# Altium project oysm_Keyboard.PrjPCB
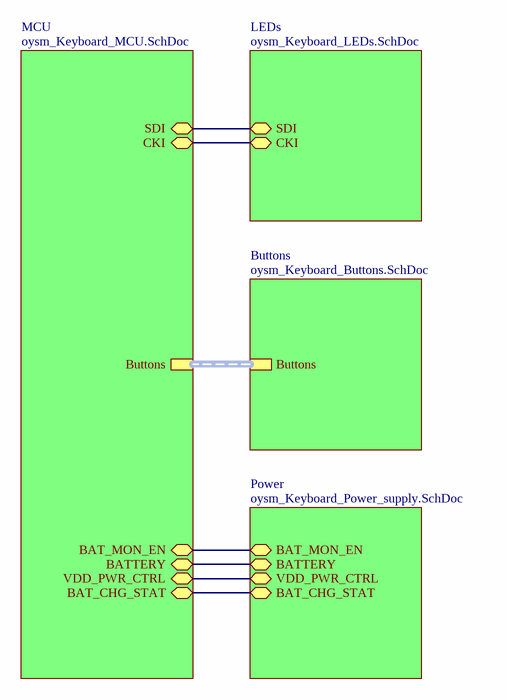
[diagram p0: oysm_Keyboard_Top.SchDoc]
5 sheets, 115 parts. Net scope: hierarchical (ports join the sheet entries above them; power ports are global).
Board file: oysm_Keyboard.PcbDoc
Sheets:
  oysm_Keyboard_Top.SchDoc
    MCU = oysm_Keyboard_MCU.SchDoc
    Power = oysm_Keyboard_Power_supply.SchDoc
    Buttons = oysm_Keyboard_Buttons.SchDoc
    LEDs = oysm_Keyboard_LEDs.SchDoc

## Sheet oysm_Keyboard_Top.SchDoc: PCA70107 Top
size A4; DocumentNumber: 1; Revision: 0; SheetNumber: 1; SheetTotal: 4; ProjectNumber: <Project number>; DocumentSize: A4; PCBRevision: <PCB designer code>

### Sub-sheets
Buttons = oysm_Keyboard_Buttons.SchDoc: Buttons (harness Harness)
LEDs = oysm_Keyboard_LEDs.SchDoc: SDI (bidir), CKI (bidir)
MCU = oysm_Keyboard_MCU.SchDoc: Buttons (harness Harness), BATTERY (bidir), BAT_MON_EN (bidir), BAT_CHG_STAT (bidir), VDD_PWR_CTRL (bidir), SDI (bidir), CKI (bidir)
Power = oysm_Keyboard_Power_supply.SchDoc: BAT_MON_EN (bidir), BATTERY (bidir), VDD_PWR_CTRL (bidir), BAT_CHG_STAT (bidir)

### Nets
P0.04/AIN2: sheet MCU/BATTERY, sheet Power/BATTERY
P0.06: sheet MCU/SDI, sheet LEDs/SDI
P0.13: sheet MCU/VDD_PWR_CTRL, sheet Power/VDD_PWR_CTRL
P0.15: sheet MCU/BAT_MON_EN, sheet Power/BAT_MON_EN
P0.26: sheet MCU/CKI, sheet LEDs/CKI
P1.00/TRC0: sheet MCU/BAT_CHG_STAT, sheet Power/BAT_CHG_STAT

### Buses and harness runs
harness sheet Buttons/Buttons = sheet MCU/Buttons

### Notes on the sheet
- Title
- Size
- Date:
- Project Number
- Sheet         of
- Revision
- File:
- Drawn By:

## Sheet oysm_Keyboard_MCU.SchDoc: PCA70141 MCU
size A3; DocumentNumber: 2; Revision: 0; SheetNumber: 2; SheetTotal: 4; ProjectNumber: <Project number>; DocumentSize: A4; PCBRevision: <PCB designer code>
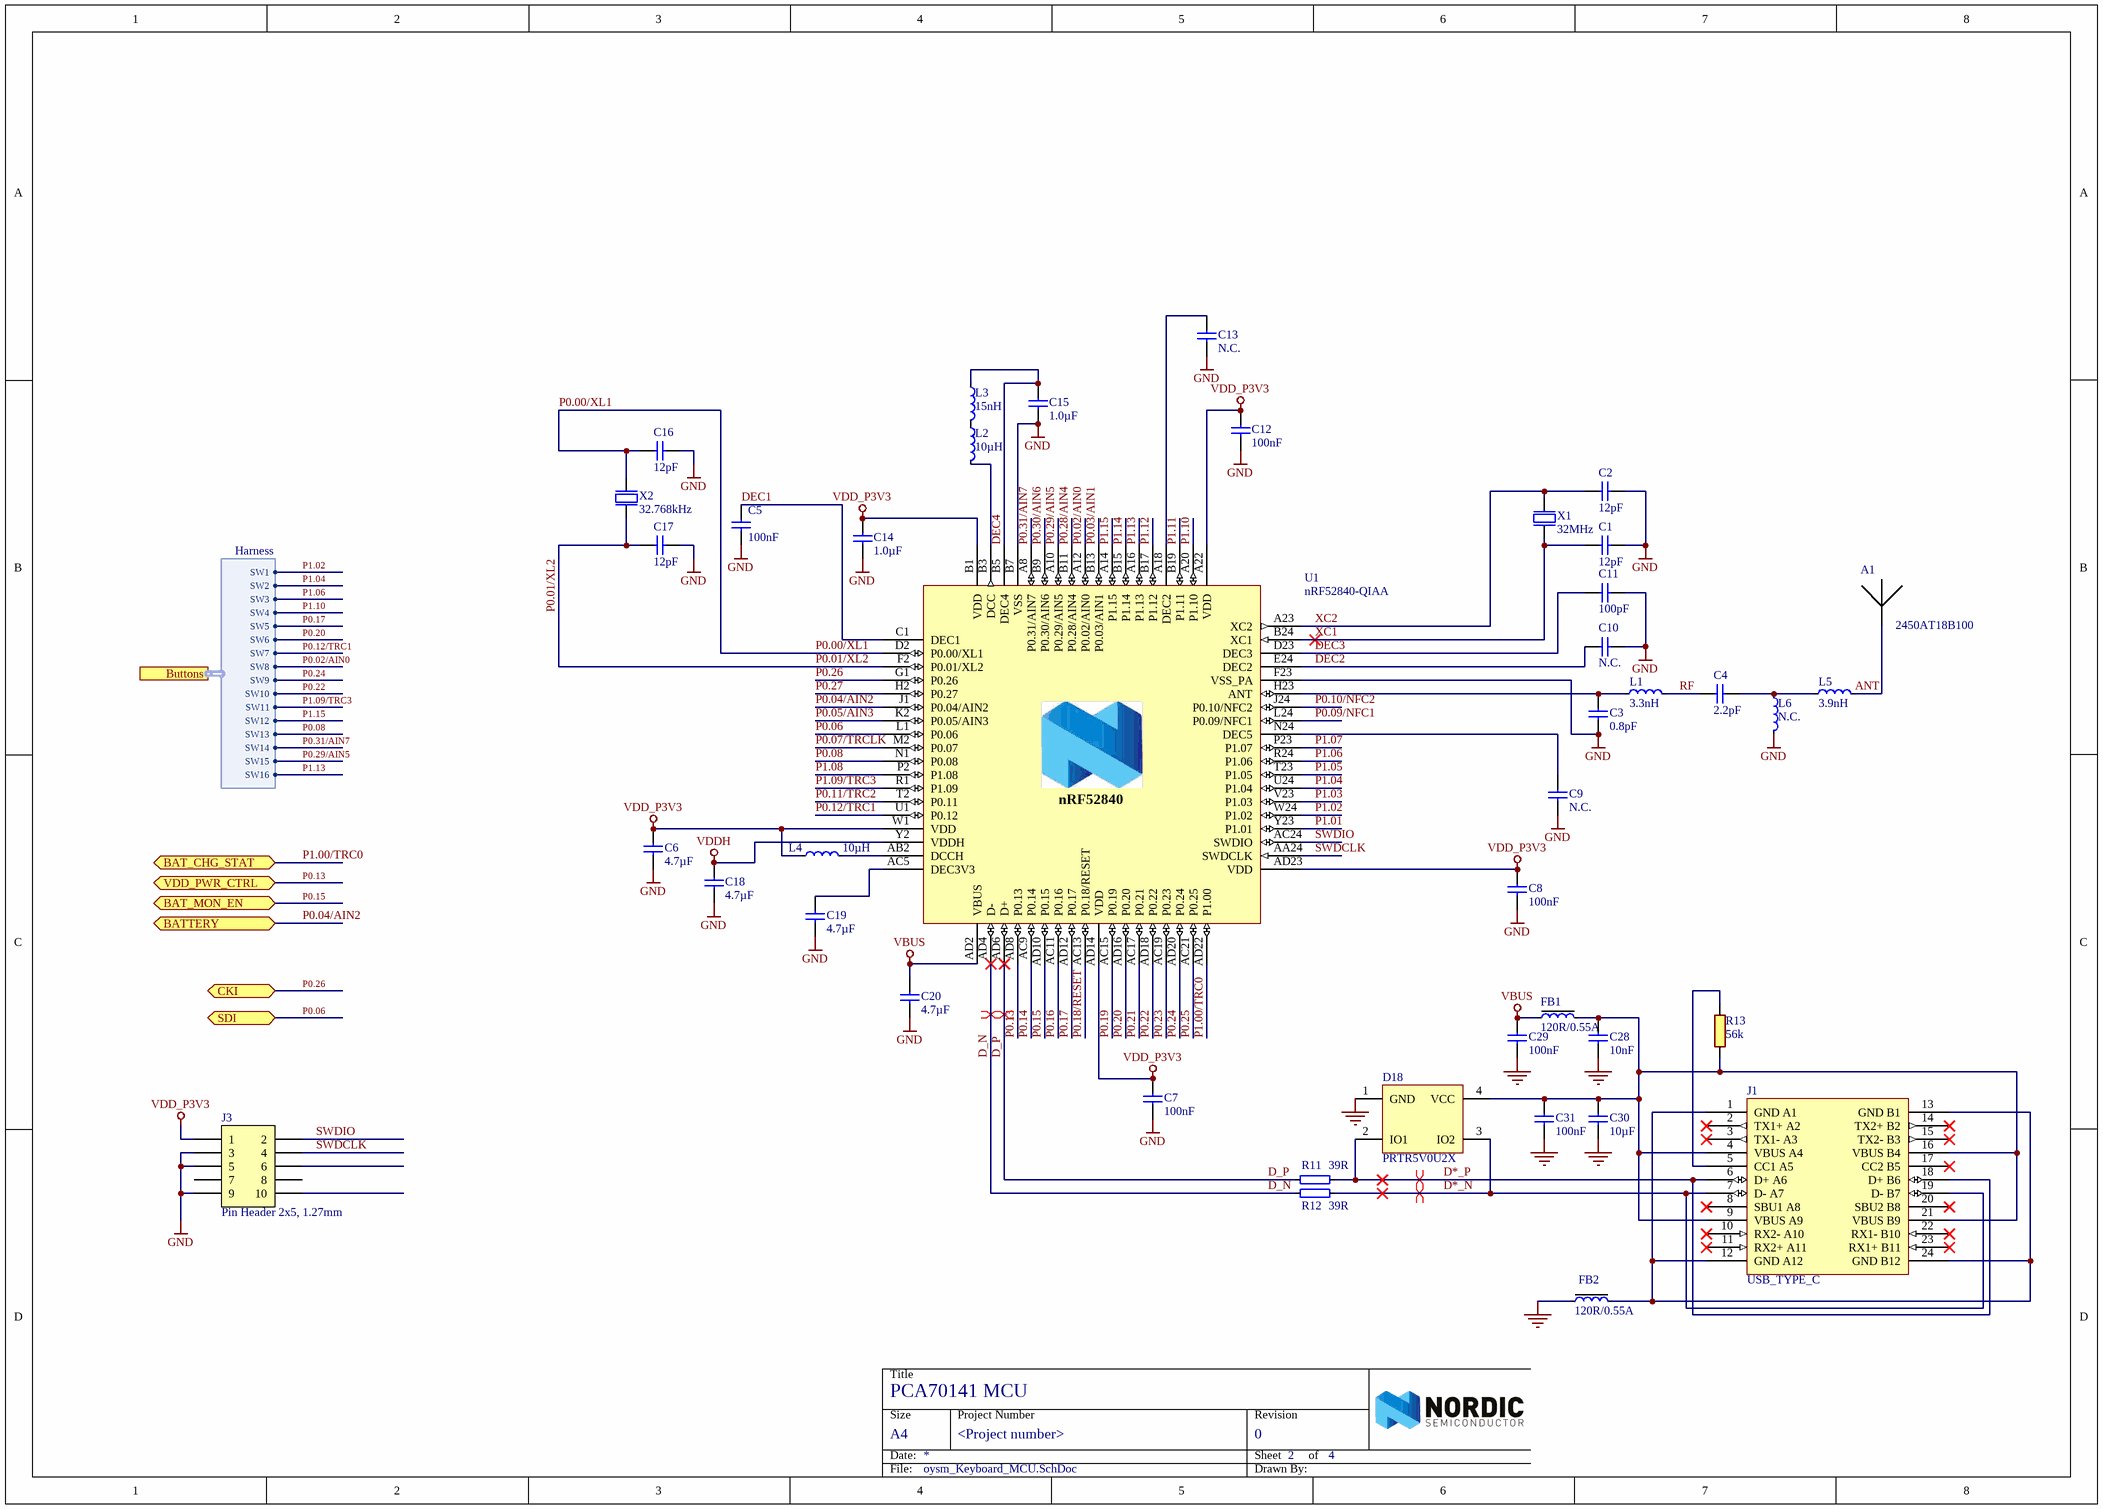
[diagram p1: oysm_Keyboard_MCU.SchDoc]

### Parts
A1  2450AT18B100  [2450AT18B100]
C1  12pF  [CAPC1005X04L]
C2  12pF  [CAPC1005X04L]
C3  0.8pF  [CAPC1005X04L]
C4  2.2pF  [CAPC1005X04L]
C5  100nF  [CAPC1005X04L]
C6  4.7µF  [CAPC1608X06L]
C7  100nF  [CAPC1005X04L]
C8  100nF  [CAPC1005X04L]
C9  N.C.  [CAPC1005X04L]
C10  N.C.  [CAPC1005X04L]
C11  100pF  [CAPC1005X04L]
C12  100nF  [CAPC1005X04L]
C13  N.C.  [CAPC1005X04L]
C14  1.0µF  [CAPC1608X06L]
C15  1.0µF  [CAPC1608X06L]
C16  12pF  [CAPC1005X04L]
C17  12pF  [CAPC1005X04L]
C18  4.7µF  [CAPC1608X06L]
C19  4.7µF  [CAPC1608X06L]
C20  4.7µF  [CAPC1608X06L]
C28  10nF  [CAPC1005X04L]
C29  100nF  [CAPC1005X04L]
C30  10µF  [CAPC1608X06L]
C31  100nF  [CAPC1005X04L]
D18  PRTR5V0U2X  [SOT190P230X110-4L]
FB1  120R/0.55A  [INDC1005X04L]
FB2  120R/0.55A  [INDC1005X04L]
J1  USB_TYPE_C  [USB_TYPE_C_JST]
J3  Pin Header 2x5, 1.27mm  [HDR_2x5-SMD-1.27mm-K]
L1  3.3nH  [INDC1005X04L]
L2  10µH  [INDC1608X06L]
L3  15nH  [INDC1005X04L]
L4  10µH  [INDC1608X06L]
L5  3.9nH  [INDC1005X04L]
L6  N.C.  [INDC1005X04L]
R11  39R  [RESC1005X04L]
R12  39R  [RESC1005X04L]
R13  56k  [RESC0402(1005)_L]
U1  nRF52840-QIAA  [AQFN50P700X700X85_HS-74N]
X1  32MHz  [BT-XTAL_2016]
X2  32.768kHz  [XTAL_3215]

### Ports
BAT_CHG_STAT (bidir), BAT_MON_EN (bidir), BATTERY (bidir), Buttons (harness Harness), CKI (bidir), SDI (bidir), VDD_PWR_CTRL (bidir)

### Harnesses
Harness: SW1, SW2, SW3, SW4, SW5, SW6, SW7, SW8, SW9, SW10, SW11, SW12, SW13, SW14, SW15, SW16

### Nets
GND: C1.2 C2.2 C3.1 C5.2 C6.2 C7.2 C8.2 C9.2 C10.1 C11.2 C12.2 C13.2 C14.2 C15.1 C16.1 C17.1 C18.2 C19.2 C20.2 C28.1 C29.1 C30.1 C31.1 D18.1(GND) FB2.2 J3.3 J3.5 J3.9 L6.2 U1.74(GND) U1.B7(VSS) U1.F23(VSS_PA) X1.2(GND) X1.4(GND)
VBUS: C20.1 C29.2 FB1.2 U1.AD2(VBUS)
VDD_P3V3: C6.1 C7.1 C8.1 C12.1 C14.1 J3.1 L4.1 U1.A22(VDD) U1.AD14(VDD) U1.AD23(VDD) U1.B1(VDD) U1.W1(VDD)
VDDH: C18.1 U1.Y2(VDDH)
ANT: A1.1 L5.2
D*_N: D18.3(IO2) J1.7(D-_A7) J1.19(D-_B7) R11.2
D*_P: D18.2(IO1) J1.6(D+_A6) J1.18(D+_B6) R12.2
D_N: R11.1 U1.AD4(D-)
D_P: R12.1 U1.AD6(D+)
DEC1: C5.1 U1.C1(DEC1)
DEC2: C10.2 U1.E24(DEC2)
DEC3: C11.1 U1.D23(DEC3)
DEC4: C15.2 L3.1 U1.B5(DEC4)
P0.00/XL1: C16.2 U1.D2(P0.00/XL1) X2.1(inp)
P0.01/XL2: C17.2 U1.F2(P0.01/XL2) X2.2(out)
P0.02/AIN0: U1.A12(P0.02/AIN0) ; port Buttons.SW8
P0.03/AIN1: U1.B13(P0.03/AIN1)
P0.04/AIN2: U1.J1(P0.04/AIN2) ; port BATTERY
P0.05/AIN3: U1.K2(P0.05/AIN3)
P0.06: U1.L1(P0.06) ; port SDI
P0.07/TRCLK: U1.M2(P0.07)
P0.08: U1.N1(P0.08) ; port Buttons.SW13
P0.09/NFC1: U1.L24(P0.09/NFC1)
P0.10/NFC2: U1.J24(P0.10/NFC2)
P0.11/TRC2: U1.T2(P0.11)
P0.12/TRC1: U1.U1(P0.12) ; port Buttons.SW7
P0.13: U1.AD8(P0.13) ; port VDD_PWR_CTRL
P0.14: U1.AC9(P0.14)
P0.15: U1.AD10(P0.15) ; port BAT_MON_EN
P0.16: U1.AC11(P0.16)
P0.17: U1.AD12(P0.17) ; port Buttons.SW5
P0.18/RESET: U1.AC13(P0.18/RESET)
P0.19: U1.AC15(P0.19)
P0.20: U1.AD16(P0.20) ; port Buttons.SW6
P0.21: U1.AC17(P0.21)
P0.22: U1.AD18(P0.22) ; port Buttons.SW10
P0.23: U1.AC19(P0.23)
P0.24: U1.AD20(P0.24) ; port Buttons.SW9
P0.25: U1.AC21(P0.25)
P0.26: U1.G1(P0.26) ; port CKI
P0.27: U1.H2(P0.27)
P0.28/AIN4: U1.B11(P0.28/AIN4)
P0.29/AIN5: U1.A10(P0.29/AIN5) ; port Buttons.SW15
P0.30/AIN6: U1.B9(P0.30/AIN6)
P0.31/AIN7: U1.A8(P0.31/AIN7) ; port Buttons.SW14
P1.00/TRC0: U1.AD22(P1.00) ; port BAT_CHG_STAT
P1.01: U1.Y23(P1.01)
P1.02: U1.W24(P1.02) ; port Buttons.SW1
P1.03: U1.V23(P1.03)
P1.04: U1.U24(P1.04) ; port Buttons.SW2
P1.05: U1.T23(P1.05)
P1.06: U1.R24(P1.06) ; port Buttons.SW3
P1.07: U1.P23(P1.07)
P1.08: U1.P2(P1.08)
P1.09/TRC3: U1.R1(P1.09) ; port Buttons.SW11
P1.10: U1.A20(P1.10) ; port Buttons.SW4
P1.11: U1.B19(P1.11)
P1.12: U1.B17(P1.12)
P1.13: U1.A16(P1.13) ; port Buttons.SW16
P1.14: U1.B15(P1.14)
P1.15: U1.A14(P1.15) ; port Buttons.SW12
RF: C4.2 L1.2
SWDCLK: J3.4 U1.AA24(SWDCLK)
SWDIO: J3.2 U1.AC24(SWDIO)
XC1: C1.1 U1.B24(XC1) X1.1(inp)
XC2: C2.1 U1.A23(XC2) X1.3(out)
NetC3_2: C3.2 L1.1 U1.H23(ANT)
NetC4_1: C4.1 L5.1 L6.1
NetC9_1: C9.1 U1.N24(DEC5)
NetC13_1: C13.1 U1.A18(DEC2)
NetC19_1: C19.1 U1.AC5(DEC3V3)
NetC28_2: C28.2 C30.2 C31.2 D18.4(VCC) FB1.1 J1.4(VBUS_A4) J1.9(VBUS_A9) J1.16(VBUS_B4) J1.21(VBUS_B9) R13.1
NetFB2_1: FB2.1 J1.1(GND_A1) J1.12(GND_A12) J1.13(GND_B1) J1.24(GND_B12)
NetJ1_5: J1.5(CC1_A5) R13.2
NetL2_1: L2.1 L3.2
NetL2_2: L2.2 U1.B3(DCC)
NetL4_2: L4.2 U1.AB2(DCCH)

Not connected (* = marked no-connect by the designer): J1 2(TX1+_A2)* 3(TX1-_A3)* 8(SBU1_A8)* 10(RX2-_A10)* 11(RX2+_A11)* 14(TX2+_B2)* 15(TX2-_B3)* 17(CC2_B5)* 20(SBU2_B8)* 22(RX1-_B10)* 23(RX1+_B11)*; J3 6 7 8 10

### Layout directives
differential pair: D*_N, D*_P, D_N, D_P

### Notes on the sheet
- Title
- Size
- Date:
- Project Number
- Sheet         of
- Revision
- File:
- Drawn By:
- (in symbol nRF52840-QIAAAA) nRF52840

### Library data of the parts
A1 = Johanson 2450AT18B100: 2.45 GHz chip antenna; Manufacturer: Johanson Technology; Part number IPS: 00000007781; Artikkelnr Noca: N.A.; Part Number: Johanson 2450AT18B100; Manufacturer Part Number: 2450AT18B100; ComponentLink1URL: *; ComponentLink1Description: Datasheet; ComponentLink2URL: *; ComponentLink2Description: Supplier link; HelpURL: http://www.johansontechnology.com/datasheets/antennas/2450AT18B100.pdf; Footprint Doc: 2450AT18B100; LatestRevisionDate: 2013-09-13; Pin Count: 2; Publisher: Nordic Semiconductor; Published: 2013-09-13; Value: 2450AT18B100; Note: *; Supplier 1: Digi-Key; Supplier Part Number 1: 712-1006-1-ND; Supplier 2: *; Supplier Part Number 2: *
C1 C2 C16 C17 = C0402-12p: Capacitor, NP0, ±2%; Part number IPS: 00000002398; Note: 50V; Artikkelnr Noca: 20029159; Artikkelnr Simpro: N.A.; Part Number: C0402-12p; Manufacturer: *; Manufacturer Part Number: *; Datasheet: *; LatestRevisionDate: 2011-05-11; Pin Count: 2; Publisher: Nordic Semiconductor; Published: 2009-05-08; Value: 12pF; Supplier: *; Supplier part number: *; 2nd source Supplier: *; 2nd source part number: *; Footprint Doc: 0402
C3 = C0402-0.8p: Capacitor, NP0, ±5%; Note: 50V; Artikkelnr Noca: 20029147; Artikkelnr Simpro: N.A.; Part Number: C0402-0.8p; Manufacturer: *; Manufacturer Part Number: *; Datasheet: *; LatestRevisionDate: 2012-11-21; Pin Count: 2; Publisher: Nordic Semiconductor; Published: 2009-05-08; Value: 0.8pF; Supplier: *; Supplier part number: *; 2nd source Supplier: *; 2nd source part number: *; Footprint Doc: 0402
C4 = C0402-2.2p: Capacitor, NP0, ±0.1pF; Part number IPS: 00000003105; Note: 50V; Artikkelnr Noca: 20029145; Part Number: C0402-2.2p; Manufacturer: *; Manufacturer Part Number: *; LatestRevisionDate: 2017-02-23; Pin Count: 2; Publisher: Nordic Semiconductor; Published: 2009-05-08; Value: 2.2pF; Footprint Doc: 0402; ComponentLink1URL: *; ComponentLink1Description: Datasheet; ComponentLink2URL: *; ComponentLink2Description: Supplier link; HelpURL: *; Supplier 1: Digi-Key; Supplier Part Number 1: 490-8092-1-ND; Supplier 2: *; Supplier Part Number 2: *
C5 C7 C8 C12 C29 C31 = C0402-100n: Capacitor, X7R, ±10%; Part number IPS: 00000005296; Note: 16V; Artikkelnr Noca: 20039200; Artikkelnr Simpro: N.A.; Part Number: C0402-100n; Manufacturer: *; Manufacturer Part Number: *; Datasheet: *; LatestRevisionDate: 2009-11-23; Pin Count: 2; Publisher: Nordic Semiconductor; Published: 2009-05-08; Value: 100nF; Supplier: *; Supplier part number: *; 2nd source Supplier: *; 2nd source part number: *; Footprint Doc: 0402
C6 = C0603-4µ7-6.3V-X7R: Capacitor, X7R, ±10%, 6.3V; Manufacturer: Samsung; Manufacturer Part Number: CL10B475KQ8NQNC; Artikkelnr Noca: 20039473; Artikkelnr Simpro: N.A.; Part Number: C0603-4µ7-6.3V-X7R; Datasheet: http://media.digikey.com/pdf/Data%20Sheets/Samsung%20PDFs/CL10B475KQ8NQNC_Spec.pdf; LatestRevisionDate: 2015-06-10; Pin Count: 2; Publisher: Nordic Semiconductor; Published: 2015-06-10; Value: 4.7µF; Note: 6.3V; Supplier: Digi-Key; Supplier part number: 1276-2087-1-ND; 2nd source Supplier: *; 2nd source part number: *; Footprint Doc: 0603
C9 C10 C13 = C0402-N.C.: Not mounted; Note: Chip Cap; Artikkelnr Noca: N.A.; Assembly: Not mounted; Part Number: C0402-N.C.; Manufacturer: *; Manufacturer Part Number: *; Datasheet: *; LatestRevisionDate: 2009-05-08; Pin Count: 2; Publisher: Nordic Semiconductor; Published: 2009-05-08; Value: N.C.; Supplier: *; Supplier part number: *; 2nd source Supplier: *; 2nd source part number: *; Footprint Doc: 0402; Artikkelnr Simpro: N.A.
C11 = C0402-100p: Capacitor, NP0, ±5%; Part number IPS: 00000002361; Note: 50V; Artikkelnr Noca: 20029135; Artikkelnr Simpro: N.A.; Part Number: C0402-100p; Manufacturer: *; Manufacturer Part Number: *; Datasheet: *; LatestRevisionDate: 2009-05-08; Pin Count: 2; Publisher: Nordic Semiconductor; Published: 2009-05-08; Value: 100pF; Supplier: *; Supplier part number: *; 2nd source Supplier: *; 2nd source part number: *; Footprint Doc: 0402
C14 C15 = C0603-1µ0: Capacitor, X7R, ±10%; Part number IPS: 00000000616; Note: 16V; Artikkelnr Noca: 20039335; Artikkelnr Simpro: N.A.; Part Number: C0603-1µ0; Manufacturer: *; Manufacturer Part Number: *; Datasheet: *; LatestRevisionDate: 2013-06-05; Pin Count: 2; Publisher: Nordic Semiconductor; Published: 2009-05-08; Value: 1.0µF; Supplier: *; Supplier part number: *; 2nd source Supplier: *; 2nd source part number: *; Footprint Doc: 0603
C18-C20 = C0603-4µ7: Capacitor, X5R, ±10%; Note: 6.3V; Artikkelnr Noca: 20069060; Artikkelnr Simpro: N.A.; Part Number: C0603-4µ7; Manufacturer: *; Manufacturer Part Number: *; Datasheet: *; LatestRevisionDate: 2009-11-23; Pin Count: 2; Publisher: Nordic Semiconductor; Published: 2009-05-08; Value: 4.7µF; Supplier: *; Supplier part number: *; 2nd source Supplier: *; 2nd source part number: *; Footprint Doc: 0603
C28 = C0402-10n: Capacitor, X7R, ±10%; Part number IPS: 00000002386; Note: 16V; Artikkelnr Noca: 20039166; Artikkelnr Simpro: N.A.; Part Number: C0402-10n; Manufacturer: *; Manufacturer Part Number: *; Datasheet: *; LatestRevisionDate: 2009-11-23; Pin Count: 2; Publisher: Nordic Semiconductor; Published: 2009-05-08; Value: 10nF; Supplier: *; Supplier part number: *; 2nd source Supplier: *; 2nd source part number: *; Footprint Doc: 0402
C30 = C0603-10µ: Capacitor, X5R, ±20%; Part number IPS: 00000003029; Note: 6.3V; Artikkelnr Noca: 20039234; Artikkelnr Simpro: N.A.; Part Number: C0603-10µ; Manufacturer: *; Manufacturer Part Number: *; Datasheet: *; LatestRevisionDate: 2011-01-17; Pin Count: 2; Publisher: Nordic Semiconductor; Published: 2011-01-17; Value: 10µF; Supplier: *; Supplier part number: *; 2nd source Supplier: *; 2nd source part number: *; Footprint Doc: 0603
D18 = PRTR5V0U2X: Ultra low capacitance double rail-to-rail ESD protection diode; Manufacturer: NXP; 2nd source part number: 152-4157; Artikkelnr Noca: 10069015; Artikkelnr Simpro: N.A.; Part Number: PRTR5V0U2X; Manufacturer Part Number: PRTR5V0U2X; Datasheet: http://www.farnell.com/datasheets/109718.pdf; LatestRevisionDate: 2012-06-11; Publisher: Nordic Semiconductor; Published: 2012-06-11; Value: PRTR5V0U2X; Note: *; Supplier: Digi-Key; Supplier part number: 568-4140-1-ND; 2nd source Supplier: Farnell; Footprint Doc: SOT-143B
FB1 FB2 = FB0402-120R@100M-500mA: Ferrite Bead, 120 Ohm @ 100MHz, 500mA, 250 mOhm Max; Manufacturer: Murata; Manufacturer Part Number: BLM15AG121SN1D; 2nd source part number: 151-5760; Note: Chip EMIFIL Inductor Type Chip Ferrite Bead; Artikkelnr Noca: 33029317; Artikkelnr Simpro: N.A.; Part Number: FB0402-120R@100M-500mA; Datasheet: http://search.murata.co.jp/Ceramy/image/img/PDF/ENG/L0110S0100BLM15A_SN.pdf; Footprint Doc: 0402; LatestRevisionDate: 2014-01-10; Pin Count: 2; Publisher: Nordic Semiconductor; Published: 2011-11-14; Value: 120R/0.55A; Supplier: Digi-Key; Supplier part number: 490-1005-1-ND; 2nd source Supplier: Farnell
J1 = 5676: TH and SMD; id: 5676; pakke_opprettet_av: 1855; leverandor_varenr: 2578451; navn: USB C connector; pris: 20; nokkelord: usb c solder; produsent: JST (JAPAN SOLDERLESS TERMINALS); leverandor: Farnell; komponenttype: 11; pakke_opprettet: 08.02.2020 21:56:58; symbol_opprettet_av: 1855; symbol_opprettet: 08.02.2020 21:55:28
J3 = Pin Header 2x5 SMD, 1.27mm, KS: Pin Header 2x5, 1.27mm (50mil), SMD, Keying Shroud; Manufacturer: W-CON; Manufacturer Part Number: 3132-10MS0BK00R1; 2nd source part number: FTSH-105-01-F-DV-K; Artikkelnr Noca: 55010009; Artikkelnr Simpro: N.A.; Part Number: Pin Header 2x5 SMD, 1.27mm, KS; Datasheet: \\hizz\pro\app9717\Datasheet\connectores\W-CON\3132-XXMXXBK00XX.pdf; Footprint Doc: HDR_2x5-SMD-1.27mm; LatestRevisionDate: 2016-04-21; Pin Count: 10; Publisher: Nordic Semiconductor; Published: 2016-01-22; Value: Pin Header 2x5, 1.27mm; Note: *; Supplier: Cabcon; Supplier part number: 3132-10MS0BK00R1; 2nd source Supplier: Samtec
L1 = L0402-3n3: Inductor, 190mA, ±0.1nH; Manufacturer: Murata; Manufacturer Part Number: LQP15MN3N3B02D; Note: High frequency chip inductor ±5%; Artikkelnr Noca: 33029369; Artikkelnr Simpro: N.A.; Part Number: L0402-3n3; Datasheet: http://search.murata.co.jp/Ceramy/image/img/PDF/ENG/L0075S0084LQP15M.pdf; LatestRevisionDate: 2012-09-19; Pin Count: 2; Publisher: Nordic Semiconductor; Published: 2009-05-08; Value: 3.3nH; Supplier: Digi-Key; Supplier part number: 490-1130-1-ND; 2nd source Supplier: *; 2nd source part number: *; Footprint Doc: 0402
L2 L4 = L0603-10µ: Inductor, 80mA, ±10%; Manufacturer: Taiyo Yuden; Manufacturer Part Number: LBMF1608T100K; 2nd source part number: 178-6105; Note: LBMF1608T100K 10µH 80mA 0603; Artikkelnr Noca: 33029314; Artikkelnr Simpro: N.A.; Part Number: L0603-10µ; Datasheet: http://www.yuden.co.jp/ut/product/pdf/elb2_e.pdf; LatestRevisionDate: 2012-09-19; Pin Count: 2; Publisher: Nordic Semiconductor; Published: 2010-02-24; Value: 10µH; Supplier: Digi-Key; Supplier part number: 587-1714-1-ND; 2nd source Supplier: Farnell; Footprint Doc: 0603
L3 = L0402-15n: Inductor, 320mA, ±5%; Manufacturer: Taiyo Yuden; Manufacturer Part Number: HK100515NJ-T; 2nd source part number: 658-1328; Note: High frequency chip inductor ±10%; Artikkelnr Noca: 33029323; Artikkelnr Simpro: N.A.; Part Number: L0402-15n; LatestRevisionDate: 2012-09-19; Pin Count: 2; Publisher: Nordic Semiconductor; Published: 2010-07-12; Value: 15nH; Supplier: Digi-Key; Datasheet: http://www.yuden.co.jp/productdata/catalog/en/mlci04_e.pdf; Supplier part number: 587-1521-1-ND; 2nd source Supplier: Farnell; Footprint Doc: 0402
L5 = L0402-3n9: Inductor, 170mA, ±0.1nH; Manufacturer: Murata; Manufacturer Part Number: LQP15MN3N9B02D; Part number IPS: 00000007793; Note: High frequency chip inductor ±5%; Artikkelnr Noca: 33029151; Part Number: L0402-3n9; LatestRevisionDate: 2012-09-19; Pin Count: 2; Publisher: Nordic Semiconductor; Published: 2009-05-08; Value: 3.9nH; Footprint Doc: 0402; ComponentLink1Description: Datasheet; ComponentLink2Description: Supplier link; ComponentLink1URL: *; ComponentLink2URL: *; HelpURL: http://search.murata.co.jp/Ceramy/image/img/PDF/ENG/L0075S0084LQP15M.pdf; Supplier 1: Digi-Key; Supplier Part Number 1: 490-1131-1-ND; Supplier 2: *; Supplier Part Number 2: *
L6 = L0402-N.C.: Not mounted; Artikkelnr Noca: N.A.; Assembly: Not mounted; Part Number: L0402-N.C.; Manufacturer: *; Manufacturer Part Number: *; LatestRevisionDate: 2016-11-24; Pin Count: 2; Publisher: Nordic Semiconductor; Published: 2016-11-24; Value: N.C.; Note: *; Footprint Doc: 0402; Part number IPS: N.A.; ComponentLink1Description: Datasheet; ComponentLink2Description: Supplier link; ComponentLink1URL: *; ComponentLink2URL: *; HelpURL: *; Supplier 1: *; Supplier Part Number 1: *; Supplier 2: *; Supplier Part Number 2: *
R11 R12 = R0402-39R: Resistor, ±1%, 0.063W; Part number IPS: 00000000821; Note: Chip Res 1%; Artikkelnr Noca: 27049039; Artikkelnr Simpro: N.A.; Value Ohm: 39; Value: 39R; Part Number: R0402-39R; Manufacturer: *; Manufacturer Part Number: *; Datasheet: *; LatestRevisionDate: 2009-11-23; Pin Count: 2; Publisher: Nordic Semiconductor; Published: 2009-05-08; Supplier: Farnell; Supplier part number: 173-8831; 2nd source Supplier: *; 2nd source part number: *; Footprint Doc: 0402
R13 = 5677: 0.1W 1% Thick film resistor; id: 5677; pakke_opprettet_av: 1855; symbol_opprettet_av: 815; pris: 0; pakketype: 0402; komponenttype: 1; pakke_opprettet: 12.05.2019 22:25:28; symbol_opprettet: 08.07.2014 21:16:33; navn: 56k
U1 = nRF52840-QIAAAA: Multi-protocol Bluetooth Low Energy, IEEE 802.15.4, ANT and 2.4GHz proprietary system-on-chip; Manufacturer: Nordic Semiconductor; Artikkelnr Noca: 15079344; Artikkelnr Simpro: N.A.; Part Number: nRF52840-QIAAAA; Manufacturer Part Number: nRF52840-QIAAAA; Datasheet: *; LatestRevisionDate: 2016-11-22; Pin Count: 73; Publisher: Nordic Semiconductor; Published: 2016-06-22; Value: nRF52840-QIAA; Note: *; Supplier: Nordic Semiconductor; Supplier part number: nRF52840-QIAAAA; 2nd source Supplier: *; 2nd source part number: *; Footprint Doc: AQFN-73
X1 = XTAL_SMD2016_32MHz_8pF_Epson: XTAL SMD 2016, 32MHz, Cl=8pF, Tol: ±10ppm, Stab: ±10ppm; Manufacturer: Epson Toyocom; Manufacturer Part Number: Q22FA12800025; Note: XTAL SMD 32.000MHz; Artikkelnr Noca: 22019238; Artikkelnr Simpro: N.A.; Part Number: XTAL_SMD2016_32MHz_8pF_Epson; Datasheet: http://www.epsondevice.com/docs/qd/en/DownloadServlet?id=ID000449; LatestRevisionDate: 2014-11-27; Pin Count: 4; Publisher: Nordic Semiconductor; Published: 2012-03-09; Value: 32MHz; Supplier: Farnell; Supplier part number: 171-2806; 2nd source Supplier: *; 2nd source part number: *; Footprint Doc: XTAL_2016
X2 = XTAL_SMD3215_32.768kHz_9pF_Kyocera_HT: XTAL SMD 3215, 32.768kHz, 9pF, ±20ppm, -40°C ~ 125°C; Manufacturer Part Number: ST3215SB32768E0HSZB1; Note: XTAL SMD 32.768kHz; Artikkelnr Noca: 22019249; Artikkelnr Simpro: N.A.; Part Number: XTAL_SMD3215_32.768kHz_9pF_Kyocera_HT; Manufacturer: Kyocera; Datasheet: http://media.digikey.com/pdf/Data%20Sheets/AVX%20PDFs/ST3215SB_Series.pdf; LatestRevisionDate: 2015-10-15; Pin Count: 2; Publisher: Nordic Semiconductor; Published: 2015-06-10; Value: 32.768kHz; Supplier: Digi-Key; Supplier part number: 1253-1402-1-ND; 2nd source Supplier: *; 2nd source part number: *; Footprint Doc: XTAL_3215

## Sheet oysm_Keyboard_Power_supply.SchDoc: PCA20020 - Power Supply
size A4; Organization: Nordic Semiconductor; DocumentNumber: 8; SheetNumber: 8; SheetTotal: 9; CompanyName: Nordic Semiconductor; DocumentSize: A4; ProjectName: oysm_Keyboard.PrjPCB
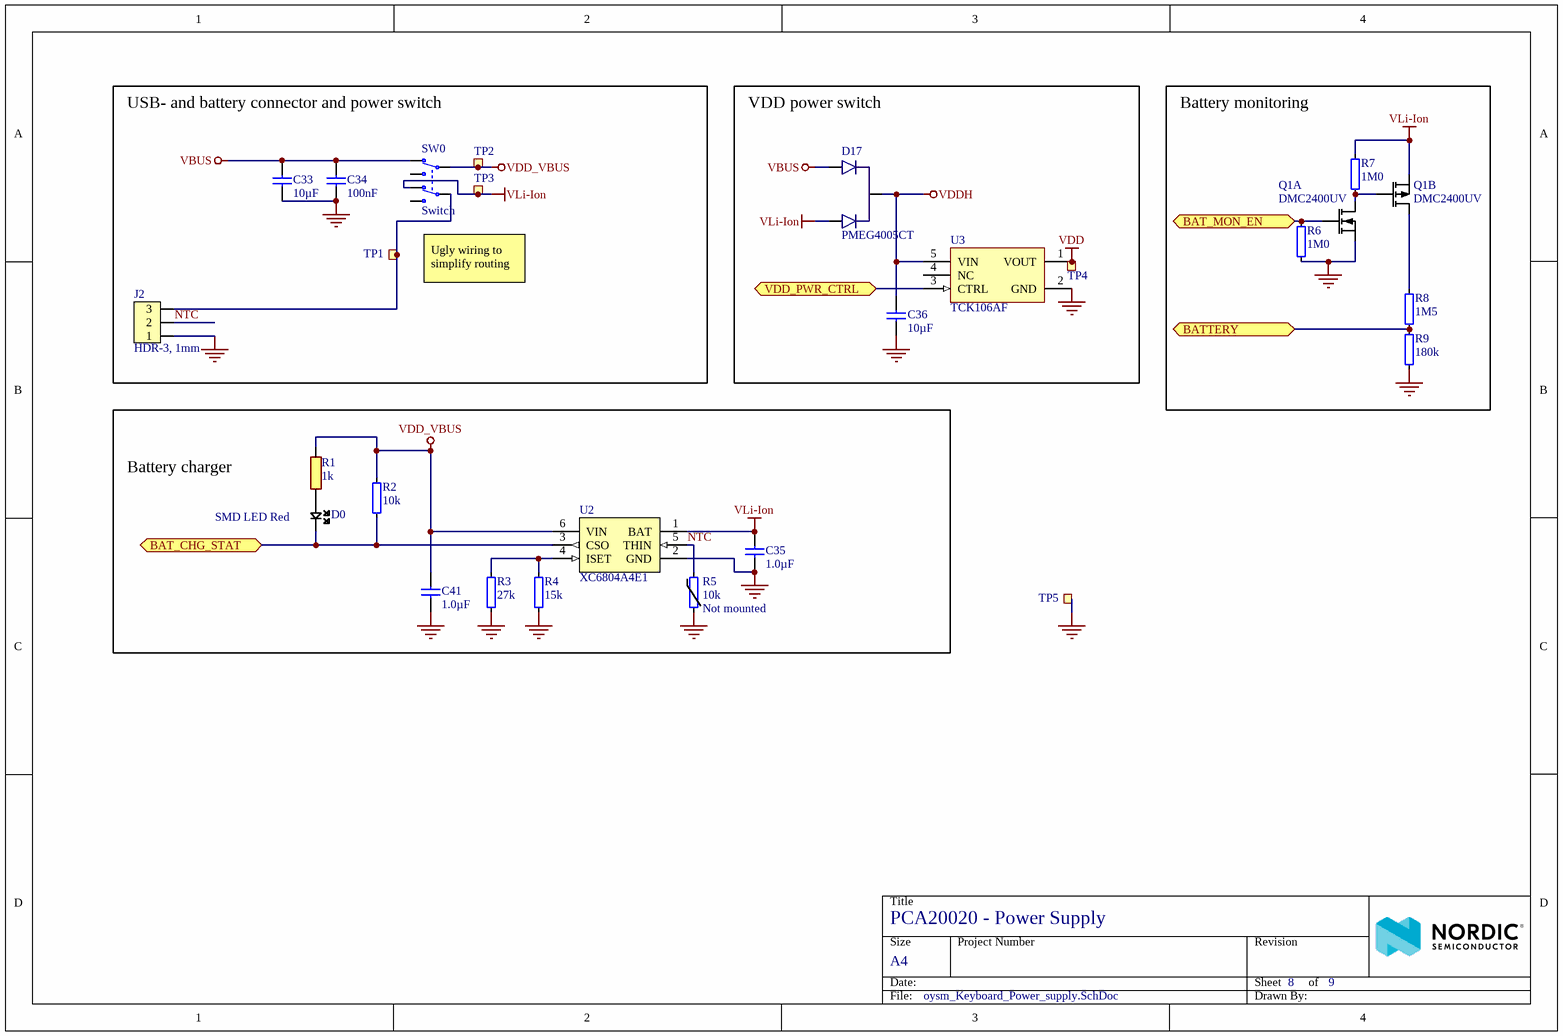
[diagram p2: oysm_Keyboard_Power_supply.SchDoc]

### Parts
C33  10µF  [CAPC1608X06L]
C34  100nF  [CAPC1005X04L]
C35  1.0µF  [CAPC1608X06L]
C36  10µF  [CAPC1608X06L]
C41  1.0µF  [CAPC1608X06L]
D0  SMD LED Red  [I_LEDC0603(1608)_N]
D17  PMEG4005CT  [SOT95P230X110-3N]
J2  HDR-3, 1mm  [SM03B-SRSS-TB]
Q1  DMC2400UV  [SOTFL50P162X60-6N]  (parts A,B of 2)
R1  1k  [RESC0603(1608)_N]
R2  10k  [RESC1005X04L]
R3  27k  [RESC1005X04L]
R4  15k  [RESC1005X04L]
R5  10k  Assembly: Not mounted  [RESC1005X04L]
R6  1M0  [RESC1005X04L]
R7  1M0  [RESC1005X04L]
R8  1M5  [RESC1005X04L]
R9  180k  [RESC1005X04L]
SW0  Switch  [Switch-Slide-RA-J-Lead-DPDT-8.5x3.5mm]
TP1  Ø1.5mm,SMD  [TP_SMD_Ø1.5mm]  (value not drawn)  (no BOM)
TP2  Ø1.5mm,SMD  [TP_SMD_Ø1.5mm]  (value not drawn)  (no BOM)
TP3  Ø1.5mm,SMD  [TP_SMD_Ø1.5mm]  (value not drawn)  (no BOM)
TP4  Ø1.5mm,SMD  [TP_SMD_Ø1.5mm]  (value not drawn)  (no BOM)
TP5  Ø1.5mm,SMD  [TP_SMD_Ø1.5mm]  (value not drawn)  (no BOM)
U2  XC6804A4E1  [USP-6EL]
U3  TCK106AF  [SOT95P280X140-5N]

### Blocks framed on the sheet
USB- and battery connector and power switch: C33 C34 J2 SW0 TP1-TP3
VDD power switch: C36 D17 TP4 U3
Battery monitoring: Q1 R6-R9
Battery charger: C35 C41 D0 R1-R5 U2

### Ports
BAT_CHG_STAT (bidir), BAT_MON_EN (bidir), BATTERY (bidir), VDD_PWR_CTRL (bidir)

### Nets
GND: C33.2 C34.2 C35.1 C36.1 C41.1 J2.1 Q1.1(S1) R3.2 R4.2 R5.2 R6.2 R9.2 TP5.1 U2.2(GND) U2.7(GND) U3.2(GND)
VBUS: C33.1 C34.1 D17.2(A) SW0.3(N.C-1)
VDD: TP4.1 U3.1(VOUT)
VDD_VBUS: C41.2 R1.2 R2.1 SW0.2(COM-1) TP2.1 U2.6(VIN)
VDDH: C36.2 D17.3(C) U3.5(VIN)
VLi-Ion: C35.2 D17.1(A) Q1.4(S2) R7.1 SW0.6(N.C-2) TP3.1 U2.1(BAT)
NTC: J2.2 R5.1 U2.5(THIN)
P0.04/AIN2: R8.2 R9.1 ; port BATTERY
P0.13: U3.3(CTRL) ; port VDD_PWR_CTRL
P0.15: Q1.2(G1) R6.1 ; port BAT_MON_EN
P1.00/TRC0: D0.2 R2.2 U2.3(CSO) ; port BAT_CHG_STAT
NetD0_1: D0.1 R1.1
NetJ2_3: J2.3 SW0.5(COM-2) TP1.1
NetQ1_3: Q1.3(D2) R8.1
NetQ1_5: Q1.5(G2) Q1.6(D1) R7.2
NetR3_1: R3.1 R4.1 U2.4(ISET)

Not connected (* = marked no-connect by the designer): SW0 1(N.O-1) 4(N.O-2); U3 4(NC)

### Notes on the sheet
- Ugly wiring to simplify routing
- Title
- Size
- Date:
- A4
- Project Number
- Sheet         of
- Revision
- File:
- Drawn By:

### Library data of the parts
C33 C36 = C0603-10µ: Capacitor, X5R, ±20%; Part number IPS: 00000007785; Note: 6.3V; Artikkelnr Noca: 20039234; Part Number: C0603-10µ; Manufacturer: *; Manufacturer Part Number: *; LatestRevisionDate: 2011-01-17; Pin Count: 2; Publisher: Nordic Semiconductor; Published: 2011-01-17; Value: 10µF; Footprint Doc: 0603; ComponentLink1URL: *; ComponentLink1Description: Datasheet; ComponentLink2URL: *; ComponentLink2Description: Supplier link; HelpURL: *; Supplier 1: *; Supplier Part Number 1: *; Supplier 2: *; Supplier Part Number 2: *
C34 = C0402-100n: Capacitor, X7R, ±10%; Part number IPS: 00000005296; Note: 16V; Artikkelnr Noca: 20039200; Part Number: C0402-100n; Manufacturer: *; Manufacturer Part Number: *; LatestRevisionDate: 2009-11-23; Pin Count: 2; Publisher: Nordic Semiconductor; Published: 2009-05-08; Value: 100nF; Footprint Doc: 0402; ComponentLink1URL: *; ComponentLink1Description: Datasheet; ComponentLink2URL: *; ComponentLink2Description: Supplier link; HelpURL: *; Supplier 1: *; Supplier Part Number 1: *; Supplier 2: *; Supplier Part Number 2: *
C35 C41 = C0603-1µ0: Capacitor, X7R, ±10%; Part number IPS: 00000000616; Note: 16V; Artikkelnr Noca: 20039282; Part Number: C0603-1µ0; Manufacturer: *; Manufacturer Part Number: *; Footprint Doc: 0603; LatestRevisionDate: 2013-06-05; Pin Count: 2; Publisher: Nordic Semiconductor; Published: 2009-05-08; Value: 1.0µF; ComponentLink1URL: *; ComponentLink1Description: Datasheet; ComponentLink2URL: *; ComponentLink2Description: Supplier link; HelpURL: *; Supplier 1: *; Supplier Part Number 1: *; Supplier 2: *; Supplier Part Number 2: *
D0 = 5143: SMD; id: 5143; rad: 0; rom: OV; lager_type: Fremlager; dybde: 2; hylle: 6; antall: 50; pakke_opprettet_av: 815; leverandor_varenr: 8554641; pris: 1; produsent: Avago; leverandor: Farnell; pakketype: 0603; komponenttype: 9; pakke_opprettet: 06/07/2014 18:55:44; symbol_opprettet_av: 815; symbol_opprettet: 06/07/2014 18:59:47; navn: SMD LED Red; nokkelord: SMD
J2 = SM03B-SRSS-TB: 1.0mm pitch connector side entry SMD; Manufacturer: JST; Manufacturer Part Number: SM03B-SRSS-TB(LF)(SN); Part number IPS: 00000001785; Note: JST, Header; Artikkelnr Noca: N.A.; Part Number: SM03B-SRSS-TB; Footprint Doc: SM03B-SRSS-TB; LatestRevisionDate: 2017-10-09; Pin Count: 3; Publisher: Nordic Semiconductor; Published: 2017-10-09; Value: HDR-3, 1mm; ComponentLink1URL: *; ComponentLink1Description: Datasheet; ComponentLink2URL: *; ComponentLink2Description: Supplier link; HelpURL: http://www.jst-mfg.com/product/pdf/eng/eSH.pdf; Supplier 1: Digi-Key; Supplier Part Number 1: 455-1803-1-ND; Supplier 2: *; Supplier Part Number 2: *
Q1 = DMC2400UV: Dual N & P Ch MOFET, 1.03A/0.7A, 480mOhm, 450mW; Manufacturer: Diodes Incorporated; Part number IPS: 00000007803; Note: Dual N & P Channel Digital FET; Artikkelnr Noca: N.A.; Part Number: DMC2400UV; Manufacturer Part Number: DMC2400UV; Footprint Doc: SOT-563; LatestRevisionDate: 2016-01-18; Pin Count: 6; Publisher: Nordic Semiconductor; Published: 2016-01-18; Value: DMC2400UV; Supplier 1: Digi-Key; Supplier Part Number 1: DMC2400UV-7DICT-ND; Supplier 2: *; Supplier Part Number 2: *; ComponentLink1URL: *; ComponentLink1Description: Datasheet; ComponentLink2URL: *; ComponentLink2Description: Supplier link; HelpURL: http://www.diodes.com/_files/datasheets/DMC2400UV.pdf
R1 = 5389: 0.1W 1% Thick film resistor; id: 5389; rad: -1; rom: OV; lager_type: Fremlager; dybde: 48; hylle: 2; antall: 100; pakke_opprettet_av: 815; pris: 0; pakketype: 0603; komponenttype: 1; pakke_opprettet: 08/07/2014 21:15:30; symbol_opprettet_av: 815; symbol_opprettet: 08/07/2014 21:16:33; navn: 1k
R2 = R0402-10k: Resistor, ±1%, 0.063W; Part number IPS: 00000002093; Note: Chip Res 1%; Artikkelnr Noca: 27049097; Part Number: R0402-10k; Manufacturer: *; Manufacturer Part Number: *; LatestRevisionDate: 2009-11-23; Pin Count: 2; Publisher: Nordic Semiconductor; Published: 2009-05-08; Value: 10k; Footprint Doc: 0402; ComponentLink1URL: *; ComponentLink1Description: Datasheet; ComponentLink2URL: *; ComponentLink2Description: Supplier link; HelpURL: *; Supplier 1: Farnell; Supplier Part Number 1: 173-8864; Supplier 2: *; Supplier Part Number 2: *
R3 = R0402-27k: Resistor, ±1%, 0.063W; Part number IPS: 00000004188; Note: Chip Res 1%; Artikkelnr Noca: 27049107; Part Number: R0402-27k; Manufacturer: *; Manufacturer Part Number: *; LatestRevisionDate: 2009-11-23; Pin Count: 2; Publisher: Nordic Semiconductor; Published: 2009-05-08; Value: 27k; Footprint Doc: 0402; ComponentLink1URL: *; ComponentLink1Description: Datasheet; ComponentLink2URL: *; ComponentLink2Description: Supplier link; HelpURL: *; Supplier 1: Farnell; Supplier Part Number 1: 173-8869; Supplier 2: *; Supplier Part Number 2: *
R4 = R0402-15k: Resistor, ±1%, 0.063W; Part number IPS: 00000002098; Note: Chip Res 1%; Artikkelnr Noca: 27049101; Part Number: R0402-15k; Manufacturer: *; Manufacturer Part Number: *; LatestRevisionDate: 2009-11-23; Pin Count: 2; Publisher: Nordic Semiconductor; Published: 2009-05-08; Value: 15k; Footprint Doc: 0402; ComponentLink1URL: *; ComponentLink1Description: Datasheet; ComponentLink2URL: *; ComponentLink2Description: Supplier link; HelpURL: *; Supplier 1: Farnell; Supplier Part Number 1: 173-8866; Supplier 2: *; Supplier Part Number 2: *
R5 = NCP15XH103F03RC: THERMISTOR 10K OHM NTC 0402 SMD; Manufacturer: Murata; Part number IPS: 00000007808; Note: Chip Res 1%; Artikkelnr Noca: N.A.; Part Number: NCP15XH103F03RC; Manufacturer Part Number: NCP15XH103F03RC; LatestRevisionDate: 2015-03-25; Pin Count: 2; Publisher: Nordic Semiconductor; Published: 2015-03-25; Value: 10k; Footprint Doc: 0402; ComponentLink1URL: *; ComponentLink1Description: Datasheet; ComponentLink2URL: *; ComponentLink2Description: Supplier link; HelpURL: *; Supplier 1: Digi-Key; Supplier Part Number 1: 490-4801-1-ND; Supplier 2: Farnell; Supplier Part Number 2: 245-6121
R6 R7 = R0402-1M0: Resistor, ±1%, 0.063W; Part number IPS: 00000006807; Note: Chip Res 1%; Artikkelnr Noca: 27049145; Part Number: R0402-1M0; Manufacturer: *; Manufacturer Part Number: *; LatestRevisionDate: 2009-11-23; Pin Count: 2; Publisher: Nordic Semiconductor; Published: 2009-05-08; Value: 1M0; Footprint Doc: 0402; ComponentLink1URL: *; ComponentLink1Description: Datasheet; ComponentLink2URL: *; ComponentLink2Description: Supplier link; HelpURL: *; Supplier 1: *; Supplier Part Number 1: *; Supplier 2: *; Supplier Part Number 2: *
R8 = R0402-1M5: Resistor, ±1%, 0.063W; Part number IPS: 00000007809; Note: Chip Res 1%; Artikkelnr Noca: 27049149; Part Number: R0402-1M5; Manufacturer: *; Manufacturer Part Number: *; LatestRevisionDate: 2009-11-23; Pin Count: 2; Publisher: Nordic Semiconductor; Published: 2009-05-08; Value: 1M5; Footprint Doc: 0402; ComponentLink1URL: *; ComponentLink1Description: Datasheet; ComponentLink2URL: *; ComponentLink2Description: Supplier link; HelpURL: *; Supplier 1: *; Supplier Part Number 1: *; Supplier 2: *; Supplier Part Number 2: *
R9 = R0402-180k: Resistor, ±1%, 0.063W; Part number IPS: 00000007810; Note: Chip Res 1%; Artikkelnr Noca: 27049127; Part Number: R0402-180k; Manufacturer: *; Manufacturer Part Number: *; LatestRevisionDate: 2009-11-23; Pin Count: 2; Publisher: Nordic Semiconductor; Published: 2009-05-08; Value: 180k; Footprint Doc: 0402; ComponentLink1URL: *; ComponentLink1Description: Datasheet; ComponentLink2URL: *; ComponentLink2Description: Supplier link; HelpURL: *; Supplier 1: *; Supplier Part Number 1: *; Supplier 2: *; Supplier Part Number 2: *
SW0 = Switch-Slide-RA-J-Lead-DPDT-8.5x3.5mm_C&K: SMD slide Switch (ON-ON); Manufacturer: C&K Components; Manufacturer Part Number: JS202011JAQN; Part number IPS: 00000007811; Artikkelnr Noca: N.A.; Part Number: Switch-Slide-RA-J-Lead-DPDT-8.5x3.5mm_C&K; Footprint Doc: Switch-Slide-RA-J-Lead-DPDT-8.5x3.5mm; LatestRevisionDate: 2017-02-01; Pin Count: 6; Publisher: Nordic Semiconductor; Published: 2016-09-15; Value: Switch; Note: *; ComponentLink1URL: *; ComponentLink1Description: Datasheet; ComponentLink2URL: *; ComponentLink2Description: Supplier link; HelpURL: http://www.ck-components.com/media/1422/js.pdf; Supplier 1: Digi-Key; Supplier Part Number 1: CKN10722CT-ND; Supplier 2: Mouser; Supplier Part Number 2: 611-JS202011JAQN
TP1-TP5 = TP_SMD_Ø1.5MM: 1.0mm circular SMD testpad; Manufacturer: Nordic Semiconductor; Artikkelnr Noca: N.A.; Part Number: TP_SMD_Ø1.5MM; Manufacturer Part Number: *; Footprint Doc: TP_SMD_Ø1.5mm; LatestRevisionDate: 2016-06-02; Pin Count: 1; Publisher: Nordic Semiconductor; Published: 2016-06-02; Value: Ø1.5mm,SMD; Note: *; Part number IPS: N.A.; ComponentLink1URL: *; ComponentLink1Description: Datasheet; ComponentLink2URL: *; ComponentLink2Description: Supplier link; HelpURL: *; Supplier 1: *; Supplier Part Number 1: *; Supplier 2: *; Supplier Part Number 2: *
U2 = XC6804A4E14R-G: One Cell Li-ion/Li-polymer Linear Charger IC with Battery Temperature Detection; Manufacturer: Torex Semiconductor; Part number IPS: 00000007825; Artikkelnr Noca: N.A.; Part Number: XC6804A4E14R-G; Manufacturer Part Number: XC6804A4E14R-G; Footprint Doc: USP-6EL; LatestRevisionDate: 2016-09-29; Pin Count: 6; Publisher: Nordic Semiconductor; Published: 2016-09-29; Value: XC6804A4E1; Note: *; ComponentLink1URL: *; ComponentLink1Description: Datasheet; ComponentLink2URL: *; ComponentLink2Description: Supplier link; HelpURL: https://www.torexsemi.com/file/xc6804/XC6804.pdf; Supplier 1: Digi-Key; Supplier Part Number 1: 893-1312-1-ND; Supplier 2: Mouser; Supplier Part Number 2: 865-XC6804A4E14R-G
U3 = TCK106AF,LF: 1.0 A Load Switch IC with Slew Rate Control Driver in Small Package; Manufacturer: Toshiba; Part number IPS: 00000007823; Artikkelnr Noca: 15070086; Part Number: TCK106AF,LF; Manufacturer Part Number: TCK106AF,LF; Footprint Doc: SOT-25; LatestRevisionDate: 2016-09-29; Pin Count: 5; Publisher: Nordic Semiconductor; Published: 2016-09-29; Value: TCK106AF; Note: *; Supplier 1: Digi-Key; Supplier Part Number 1: TCK106AFLFCT-ND; Supplier 2: *; Supplier Part Number 2: *; ComponentLink1URL: *; ComponentLink1Description: Datasheet; ComponentLink2URL: *; ComponentLink2Description: Supplier link; HelpURL: https://toshiba.semicon-storage.com/info/docget.jsp?did=53240&prodName=TCK108AF
D17 = PMEG4005CT: DigiKey: 1727-5210-1-ND; Part Number: PMEG4005CT

## Sheet oysm_Keyboard_Buttons.SchDoc: PCA70107 Connectors
size A4; DocumentNumber: 3; Revision: 0; SheetNumber: 3; SheetTotal: 4; ProjectNumber: <Project number>; DocumentSize: A4; PCBRevision: <PCB designer code>
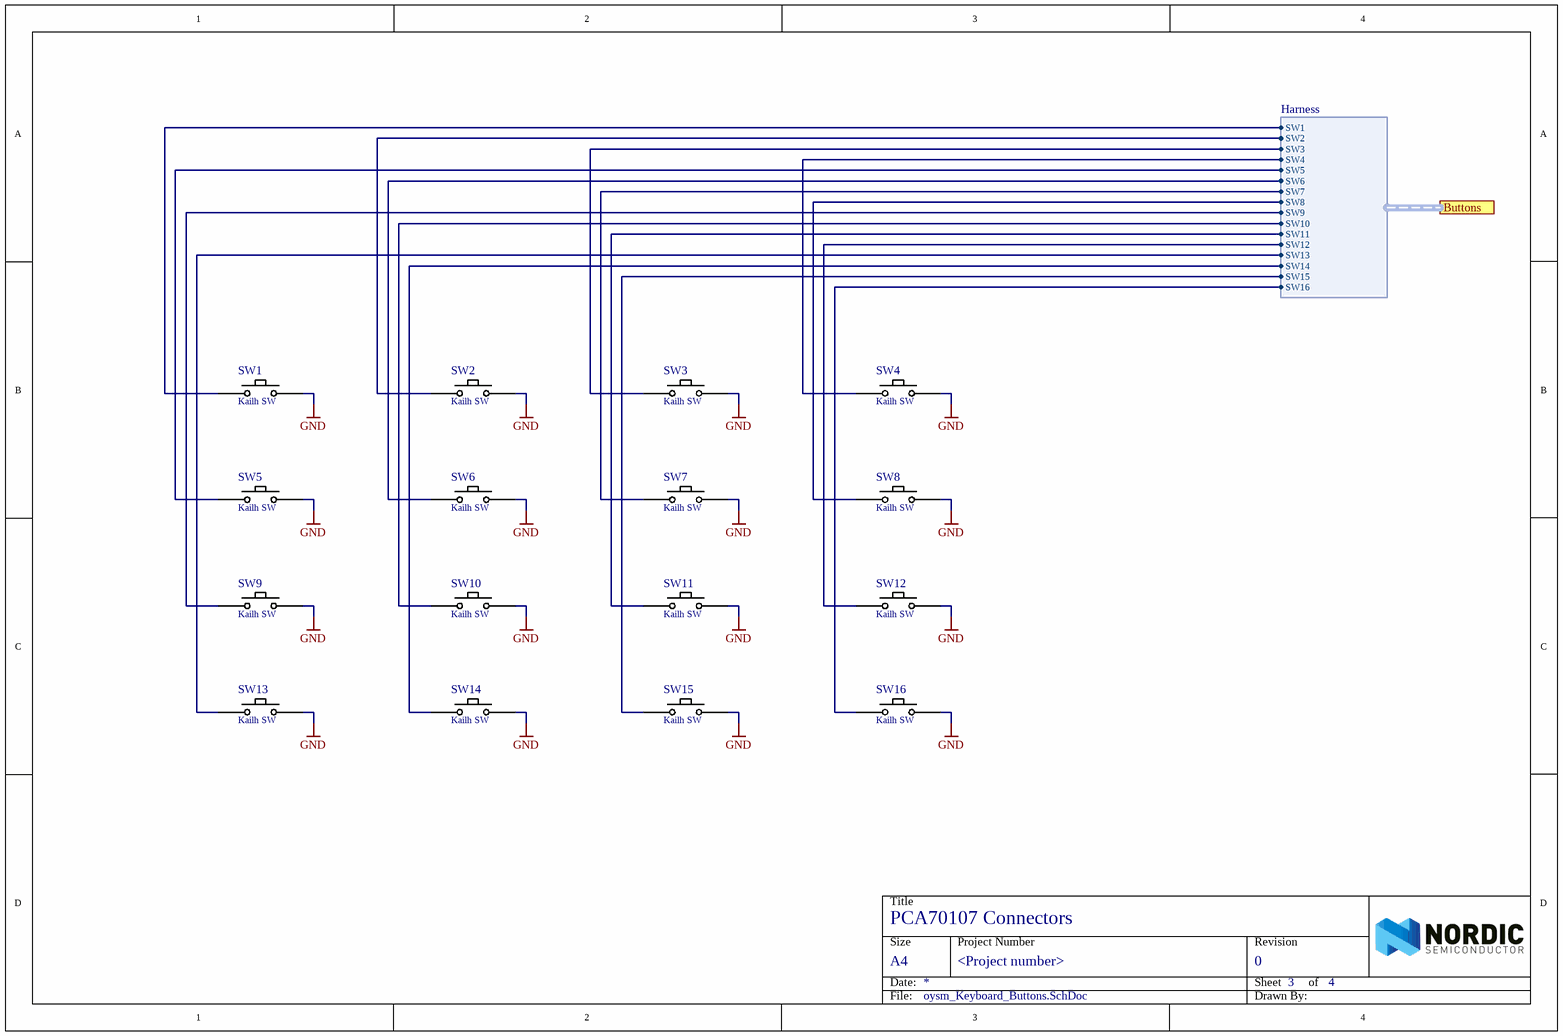
[diagram p3: oysm_Keyboard_Buttons.SchDoc]

### Parts
SW1  Kailh SW  [Kailh_Mechanical_Key]
SW2  Kailh SW  [Kailh_Mechanical_Key]
SW3  Kailh SW  [Kailh_Mechanical_Key]
SW4  Kailh SW  [Kailh_Mechanical_Key]
SW5  Kailh SW  [Kailh_Mechanical_Key]
SW6  Kailh SW  [Kailh_Mechanical_Key]
SW7  Kailh SW  [Kailh_Mechanical_Key]
SW8  Kailh SW  [Kailh_Mechanical_Key]
SW9  Kailh SW  [Kailh_Mechanical_Key]
SW10  Kailh SW  [Kailh_Mechanical_Key]
SW11  Kailh SW  [Kailh_Mechanical_Key]
SW12  Kailh SW  [Kailh_Mechanical_Key]
SW13  Kailh SW  [Kailh_Mechanical_Key]
SW14  Kailh SW  [Kailh_Mechanical_Key]
SW15  Kailh SW  [Kailh_Mechanical_Key]
SW16  Kailh SW  [Kailh_Mechanical_Key]

### Ports
Buttons (harness Harness)

### Harnesses
Harness: SW1, SW2, SW3, SW4, SW5, SW6, SW7, SW8, SW9, SW10, SW11, SW12, SW13, SW14, SW15, SW16

### Nets
GND: SW1.2 SW2.2 SW3.2 SW4.2 SW5.2 SW6.2 SW7.2 SW8.2 SW9.2 SW10.2 SW11.2 SW12.2 SW13.2 SW14.2 SW15.2 SW16.2
P0.02/AIN0: SW8.1 ; port Buttons.SW8
P0.08: SW13.1 ; port Buttons.SW13
P0.12/TRC1: SW7.1 ; port Buttons.SW7
P0.17: SW5.1 ; port Buttons.SW5
P0.20: SW6.1 ; port Buttons.SW6
P0.22: SW10.1 ; port Buttons.SW10
P0.24: SW9.1 ; port Buttons.SW9
P0.29/AIN5: SW15.1 ; port Buttons.SW15
P0.31/AIN7: SW14.1 ; port Buttons.SW14
P1.02: SW1.1 ; port Buttons.SW1
P1.04: SW2.1 ; port Buttons.SW2
P1.06: SW3.1 ; port Buttons.SW3
P1.09/TRC3: SW11.1 ; port Buttons.SW11
P1.10: SW4.1 ; port Buttons.SW4
P1.13: SW16.1 ; port Buttons.SW16
P1.15: SW12.1 ; port Buttons.SW12

### Notes on the sheet
- Title
- Size
- Date:
- Project Number
- Sheet         of
- Revision
- File:
- Drawn By:

### Library data of the parts
SW1-SW16 = 5669: Kailh Mechanical keyboard switch; id: 5669; pakke_opprettet_av: 815; pris: 0; nokkelord: button; pakketype: TH; komponenttype: 12; pakke_opprettet: 07/02/2020 14:14:39; symbol_opprettet_av: 815; symbol_opprettet: 07/02/2020 14:22:32; navn: Kailh SW; produsent: Kailh

## Sheet oysm_Keyboard_LEDs.SchDoc
size A4
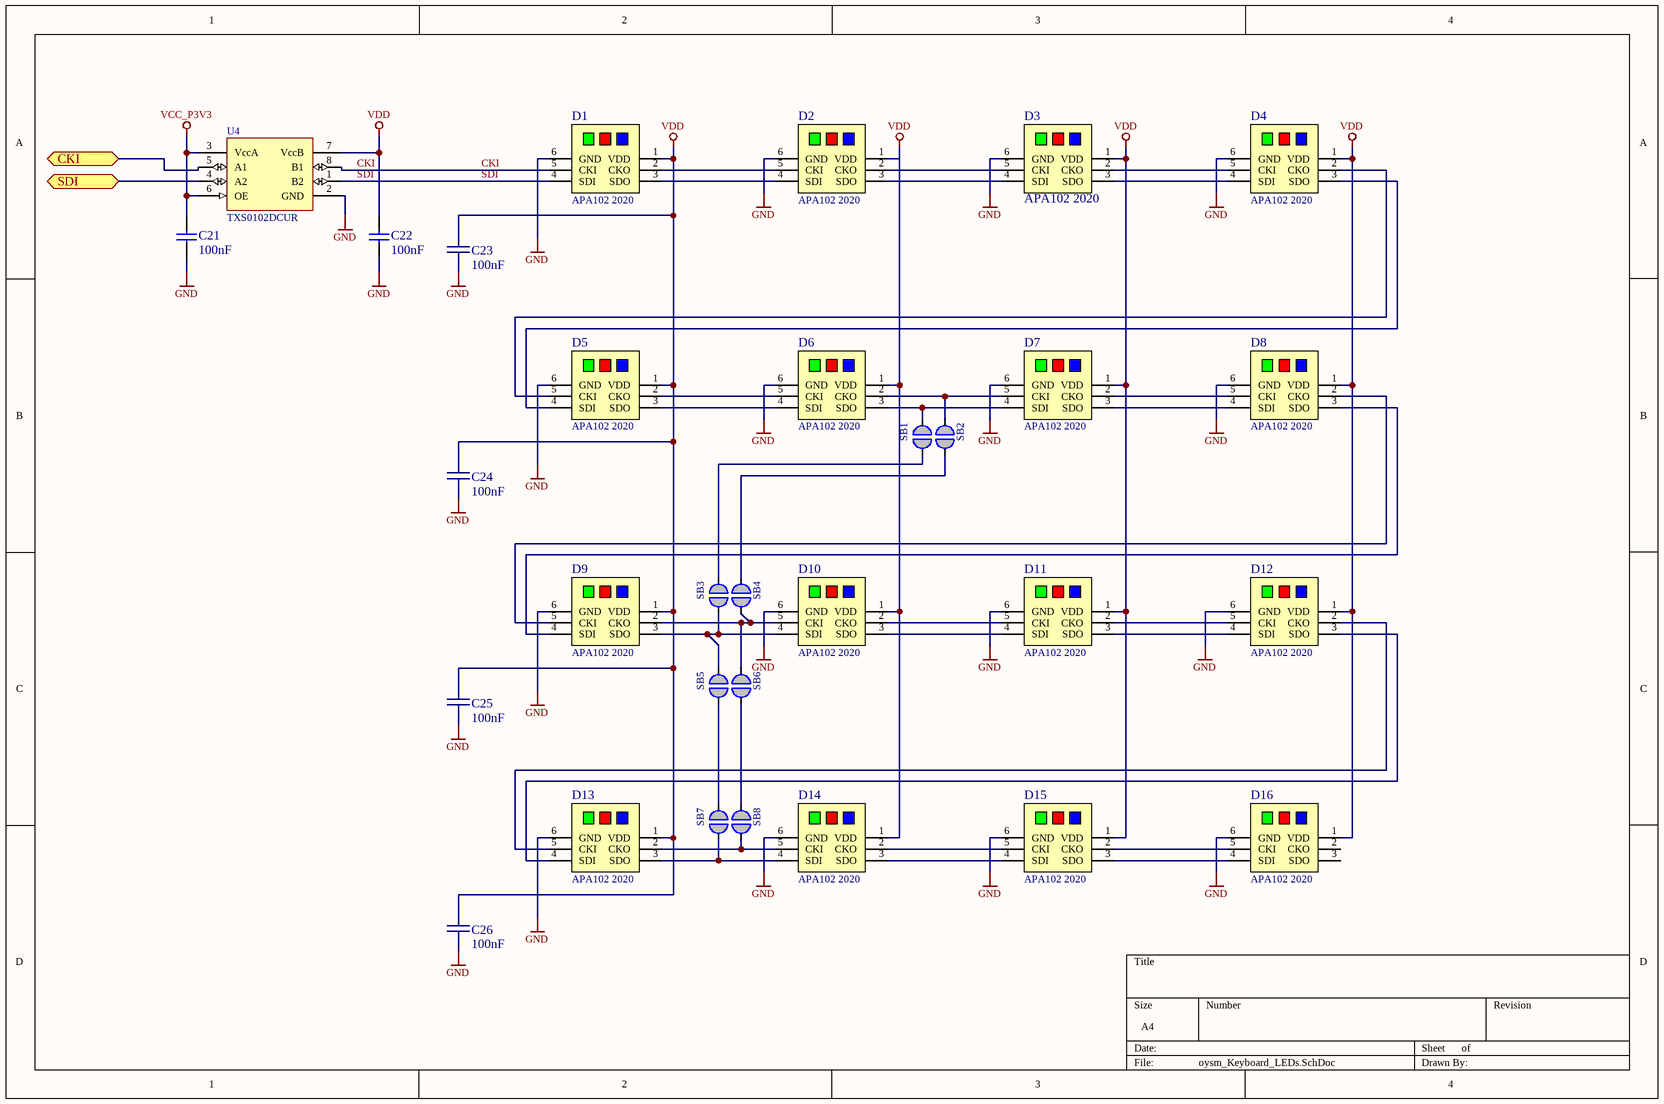
[diagram p4: oysm_Keyboard_LEDs.SchDoc]

### Parts
C21  100nF  [CAPC1005X04L]
C22  100nF  [CAPC1005X04L]
C23  100nF  [CAPC0603(1608)55_N]
C24  100nF  [CAPC0603(1608)55_N]
C25  100nF  [CAPC0603(1608)55_N]
C26  100nF  [CAPC0603(1608)55_N]
D1  APA102 2020  [APA_RGB_LED_2020]
D2  APA102 2020  [APA_RGB_LED_2020]
D3  APA102 2020  [APA_RGB_LED_2020]
D4  APA102 2020  [APA_RGB_LED_2020]
D5  APA102 2020  [APA_RGB_LED_2020]
D6  APA102 2020  [APA_RGB_LED_2020]
D7  APA102 2020  [APA_RGB_LED_2020]
D8  APA102 2020  [APA_RGB_LED_2020]
D9  APA102 2020  [APA_RGB_LED_2020]
D10  APA102 2020  [APA_RGB_LED_2020]
D11  APA102 2020  [APA_RGB_LED_2020]
D12  APA102 2020  [APA_RGB_LED_2020]
D13  APA102 2020  [APA_RGB_LED_2020]
D14  APA102 2020  [APA_RGB_LED_2020]
D15  APA102 2020  [APA_RGB_LED_2020]
D16  APA102 2020  [APA_RGB_LED_2020]
SB1  Solderbridge  [Solderbridge]  (value not drawn)  (no BOM)
SB2  Solderbridge  [Solderbridge]  (value not drawn)  (no BOM)
SB3  Solderbridge  [Solderbridge]  (value not drawn)  (no BOM)
SB4  Solderbridge  [Solderbridge]  (value not drawn)  (no BOM)
SB5  Solderbridge  [Solderbridge]  (value not drawn)  (no BOM)
SB6  Solderbridge  [Solderbridge]  (value not drawn)  (no BOM)
SB7  Solderbridge  [Solderbridge]  (value not drawn)  (no BOM)
SB8  Solderbridge  [Solderbridge]  (value not drawn)  (no BOM)
U4  TXS0102DCUR  [TSSOP50P310X90-8N]

### Ports
CKI (bidir), SDI (bidir)

### Nets
GND: C21.1 C22.1 C23.1 C24.1 C25.1 C26.1 D1.6(GND) D2.6(GND) D3.6(GND) D4.6(GND) D5.6(GND) D6.6(GND) D7.6(GND) D8.6(GND) D9.6(GND) D10.6(GND) D11.6(GND) D12.6(GND) D13.6(GND) D14.6(GND) D15.6(GND) D16.6(GND) U4.2(GND)
VCC_P3V3: C21.2 U4.3(VccA) U4.6(OE)
VDD: C22.2 C23.2 C24.2 C25.2 C26.2 D1.1(VDD) D2.1(VDD) D3.1(VDD) D4.1(VDD) D5.1(VDD) D6.1(VDD) D7.1(VDD) D8.1(VDD) D9.1(VDD) D10.1(VDD) D11.1(VDD) D12.1(VDD) D13.1(VDD) D14.1(VDD) D15.1(VDD) D16.1(VDD) U4.7(VccB)
CKI: D1.5(CKI) U4.8(B1)
P0.06: U4.4(A2) ; port SDI
P0.26: U4.5(A1) ; port CKI
SDI: D1.4(SDI) U4.1(B2)
NetD1_2: D1.2(CKO) D2.5(CKI)
NetD1_3: D1.3(SDO) D2.4(SDI)
NetD2_2: D2.2(CKO) D3.5(CKI)
NetD2_3: D2.3(SDO) D3.4(SDI)
NetD3_2: D3.2(CKO) D4.5(CKI)
NetD3_3: D3.3(SDO) D4.4(SDI)
NetD4_2: D4.2(CKO) D5.5(CKI)
NetD4_3: D4.3(SDO) D5.4(SDI)
NetD5_2: D5.2(CKO) D6.5(CKI)
NetD5_3: D5.3(SDO) D6.4(SDI)
NetD6_2: D6.2(CKO) D7.5(CKI) SB2.2
NetD6_3: D6.3(SDO) D7.4(SDI) SB1.2
NetD7_2: D7.2(CKO) D8.5(CKI)
NetD7_3: D7.3(SDO) D8.4(SDI)
NetD8_2: D8.2(CKO) D9.5(CKI)
NetD8_3: D8.3(SDO) D9.4(SDI)
NetD9_2: D9.2(CKO) D10.5(CKI) SB4.1 SB6.2
NetD9_3: D9.3(SDO) D10.4(SDI) SB3.1 SB5.2
NetD10_2: D10.2(CKO) D11.5(CKI)
NetD10_3: D10.3(SDO) D11.4(SDI)
NetD11_2: D11.2(CKO) D12.5(CKI)
NetD11_3: D11.3(SDO) D12.4(SDI)
NetD12_2: D12.2(CKO) D13.5(CKI)
NetD12_3: D12.3(SDO) D13.4(SDI)
NetD13_2: D13.2(CKO) D14.5(CKI) SB8.1
NetD13_3: D13.3(SDO) D14.4(SDI) SB7.1
NetD14_2: D14.2(CKO) D15.5(CKI)
NetD14_3: D14.3(SDO) D15.4(SDI)
NetD15_2: D15.2(CKO) D16.5(CKI)
NetD15_3: D15.3(SDO) D16.4(SDI)
NetSB1_1: SB1.1 SB3.2
NetSB2_1: SB2.1 SB4.2
NetSB5_1: SB5.1 SB7.2
NetSB6_1: SB6.1 SB8.2

Not connected (* = marked no-connect by the designer): D16 2(CKO) 3(SDO)

### Library data of the parts
C21 C22 = C0402-100n: as C5 on sheet oysm_Keyboard_MCU; Part Number: C0402-100n; Manufacturer: *; Manufacturer Part Number: *; Datasheet: *; LatestRevisionDate: 2009-11-23; Pin Count: 2; Publisher: Nordic Semiconductor; Published: 2009-05-08; Value: 100nF; Supplier: *; Supplier part number: *; 2nd source Supplier: *; 2nd source part number: *; Footprint Doc: 0402
C23-C26 = 5152: X7R 50V 5%; pakke_opprettet_av: 815; leverandor_varenr: 1759122; pris: 1; nokkelord: Kondensator, Capacitor, CAP; pakketype: 0603; produsent: Multikomp; leverandor: Farnell; id: 5152; rad: 21; rom: OV; lager_type: Baklager; dybde: 0; antall: 1000; komponenttype: 2; navn: 100nF; pakke_opprettet: 18.02.2015 14:18:13; symbol_opprettet_av: 815; symbol_opprettet: 14.11.2014 20:19:34; hylle: 0
D1-D16 = 5672: 2x2mm SMD RGB Addresserbar LED; AdaFruit: 3341; id: 5672; pakke_opprettet_av: 815; leverandor_varenr: 1528-2392-ND; pris: 0; nokkelord: Adafruit: 3341; produsent: Kina; leverandor: DigiKey; komponenttype: 9; DigiKey: 1528-2392-ND; pakke_opprettet: 08.02.2020 14:20:14; symbol_opprettet_av: 815; symbol_opprettet: 08.02.2020 14:20:38; navn: APA102 2020; pakketype: SMD
SB1-SB8 = Solderbridge: Artikkelnr Noca: N.A.; Part Number: Solderbridge; Manufacturer: *; Manufacturer Part Number: *; ComponentLink1URL: *; ComponentLink1Description: Datasheet; ComponentLink2URL: *; ComponentLink2Description: Supplier link; HelpURL: *; Footprint Doc: Solderbridge; LatestRevisionDate: 2009-12-14; Pin Count: 2; Publisher: Nordic Semiconductor; Published: 2009-12-14; Value: Solderbridge; Note: *; Supplier 1: *; Supplier Part Number 1: *; Supplier 2: *; Supplier Part Number 2: *; Part number IPS: N.A.
U4 = TXS0102DCUR: IC VOLT-LEVEL TRANSLATOR 8-US8; Manufacturer: Texas Instruments; Note: TEXAS INSTRUMENTS - TXS0102DCUR - IC, TRANSLATOR; Artikkelnr Noca: N.A.; Part Number: TXS0102DCUR; Manufacturer Part Number: TXS0102DCUR; ComponentLink1URL: *; ComponentLink1Description: Datasheet; ComponentLink2URL: *; ComponentLink2Description: Supplier link; HelpURL: http://www.ti.com/lit/ds/symlink/txs0102.pdf; Footprint Doc: 8-VFSOP; LatestRevisionDate: 2012-09-06; Pin Count: 8; Publisher: Nordic Semiconductor; Published: 2012-09-06; Value: TXS0102DCUR; Supplier 1: Digi-Key; Supplier Part Number 1: 296-21931-1-ND; Supplier 2: Farnell; Supplier Part Number 2: 170-3315; Part number IPS: N.A.

## Nets that join several sheets
GND: oysm_Keyboard_MCU (34 pins), oysm_Keyboard_Power_supply (16 pins), oysm_Keyboard_Buttons (16 pins), oysm_Keyboard_LEDs (23 pins)
VBUS: oysm_Keyboard_MCU (C20.1 C29.2 FB1.2 U1.AD2), oysm_Keyboard_Power_supply (C33.1 C34.1 D17.2 SW0.3)
VDD: oysm_Keyboard_Power_supply (TP4.1 U3.1), oysm_Keyboard_LEDs (22 pins)
VDDH: oysm_Keyboard_MCU (C18.1 U1.Y2), oysm_Keyboard_Power_supply (C36.2 D17.3 U3.5)
P0.02/AIN0: oysm_Keyboard_MCU (U1.A12), oysm_Keyboard_Buttons (SW8.1)
P0.04/AIN2: oysm_Keyboard_MCU (U1.J1), oysm_Keyboard_Power_supply (R8.2 R9.1)
P0.06: oysm_Keyboard_MCU (U1.L1), oysm_Keyboard_LEDs (U4.4)
P0.08: oysm_Keyboard_MCU (U1.N1), oysm_Keyboard_Buttons (SW13.1)
P0.12/TRC1: oysm_Keyboard_MCU (U1.U1), oysm_Keyboard_Buttons (SW7.1)
P0.13: oysm_Keyboard_MCU (U1.AD8), oysm_Keyboard_Power_supply (U3.3)
P0.15: oysm_Keyboard_MCU (U1.AD10), oysm_Keyboard_Power_supply (Q1.2 R6.1)
P0.17: oysm_Keyboard_MCU (U1.AD12), oysm_Keyboard_Buttons (SW5.1)
P0.20: oysm_Keyboard_MCU (U1.AD16), oysm_Keyboard_Buttons (SW6.1)
P0.22: oysm_Keyboard_MCU (U1.AD18), oysm_Keyboard_Buttons (SW10.1)
P0.24: oysm_Keyboard_MCU (U1.AD20), oysm_Keyboard_Buttons (SW9.1)
P0.26: oysm_Keyboard_MCU (U1.G1), oysm_Keyboard_LEDs (U4.5)
P0.29/AIN5: oysm_Keyboard_MCU (U1.A10), oysm_Keyboard_Buttons (SW15.1)
P0.31/AIN7: oysm_Keyboard_MCU (U1.A8), oysm_Keyboard_Buttons (SW14.1)
P1.00/TRC0: oysm_Keyboard_MCU (U1.AD22), oysm_Keyboard_Power_supply (D0.2 R2.2 U2.3)
P1.02: oysm_Keyboard_MCU (U1.W24), oysm_Keyboard_Buttons (SW1.1)
P1.04: oysm_Keyboard_MCU (U1.U24), oysm_Keyboard_Buttons (SW2.1)
P1.06: oysm_Keyboard_MCU (U1.R24), oysm_Keyboard_Buttons (SW3.1)
P1.09/TRC3: oysm_Keyboard_MCU (U1.R1), oysm_Keyboard_Buttons (SW11.1)
P1.10: oysm_Keyboard_MCU (U1.A20), oysm_Keyboard_Buttons (SW4.1)
P1.13: oysm_Keyboard_MCU (U1.A16), oysm_Keyboard_Buttons (SW16.1)
P1.15: oysm_Keyboard_MCU (U1.A14), oysm_Keyboard_Buttons (SW12.1)

## Assembly variants
Default assembly: not fitted C9 C10 C27 C32 R1 R2 R7 R8 R10